# Altium schematic sheet Matrix.SchDoc
size A3; DocumentNumber: 3; SheetNumber: 3; SheetTotal: 3
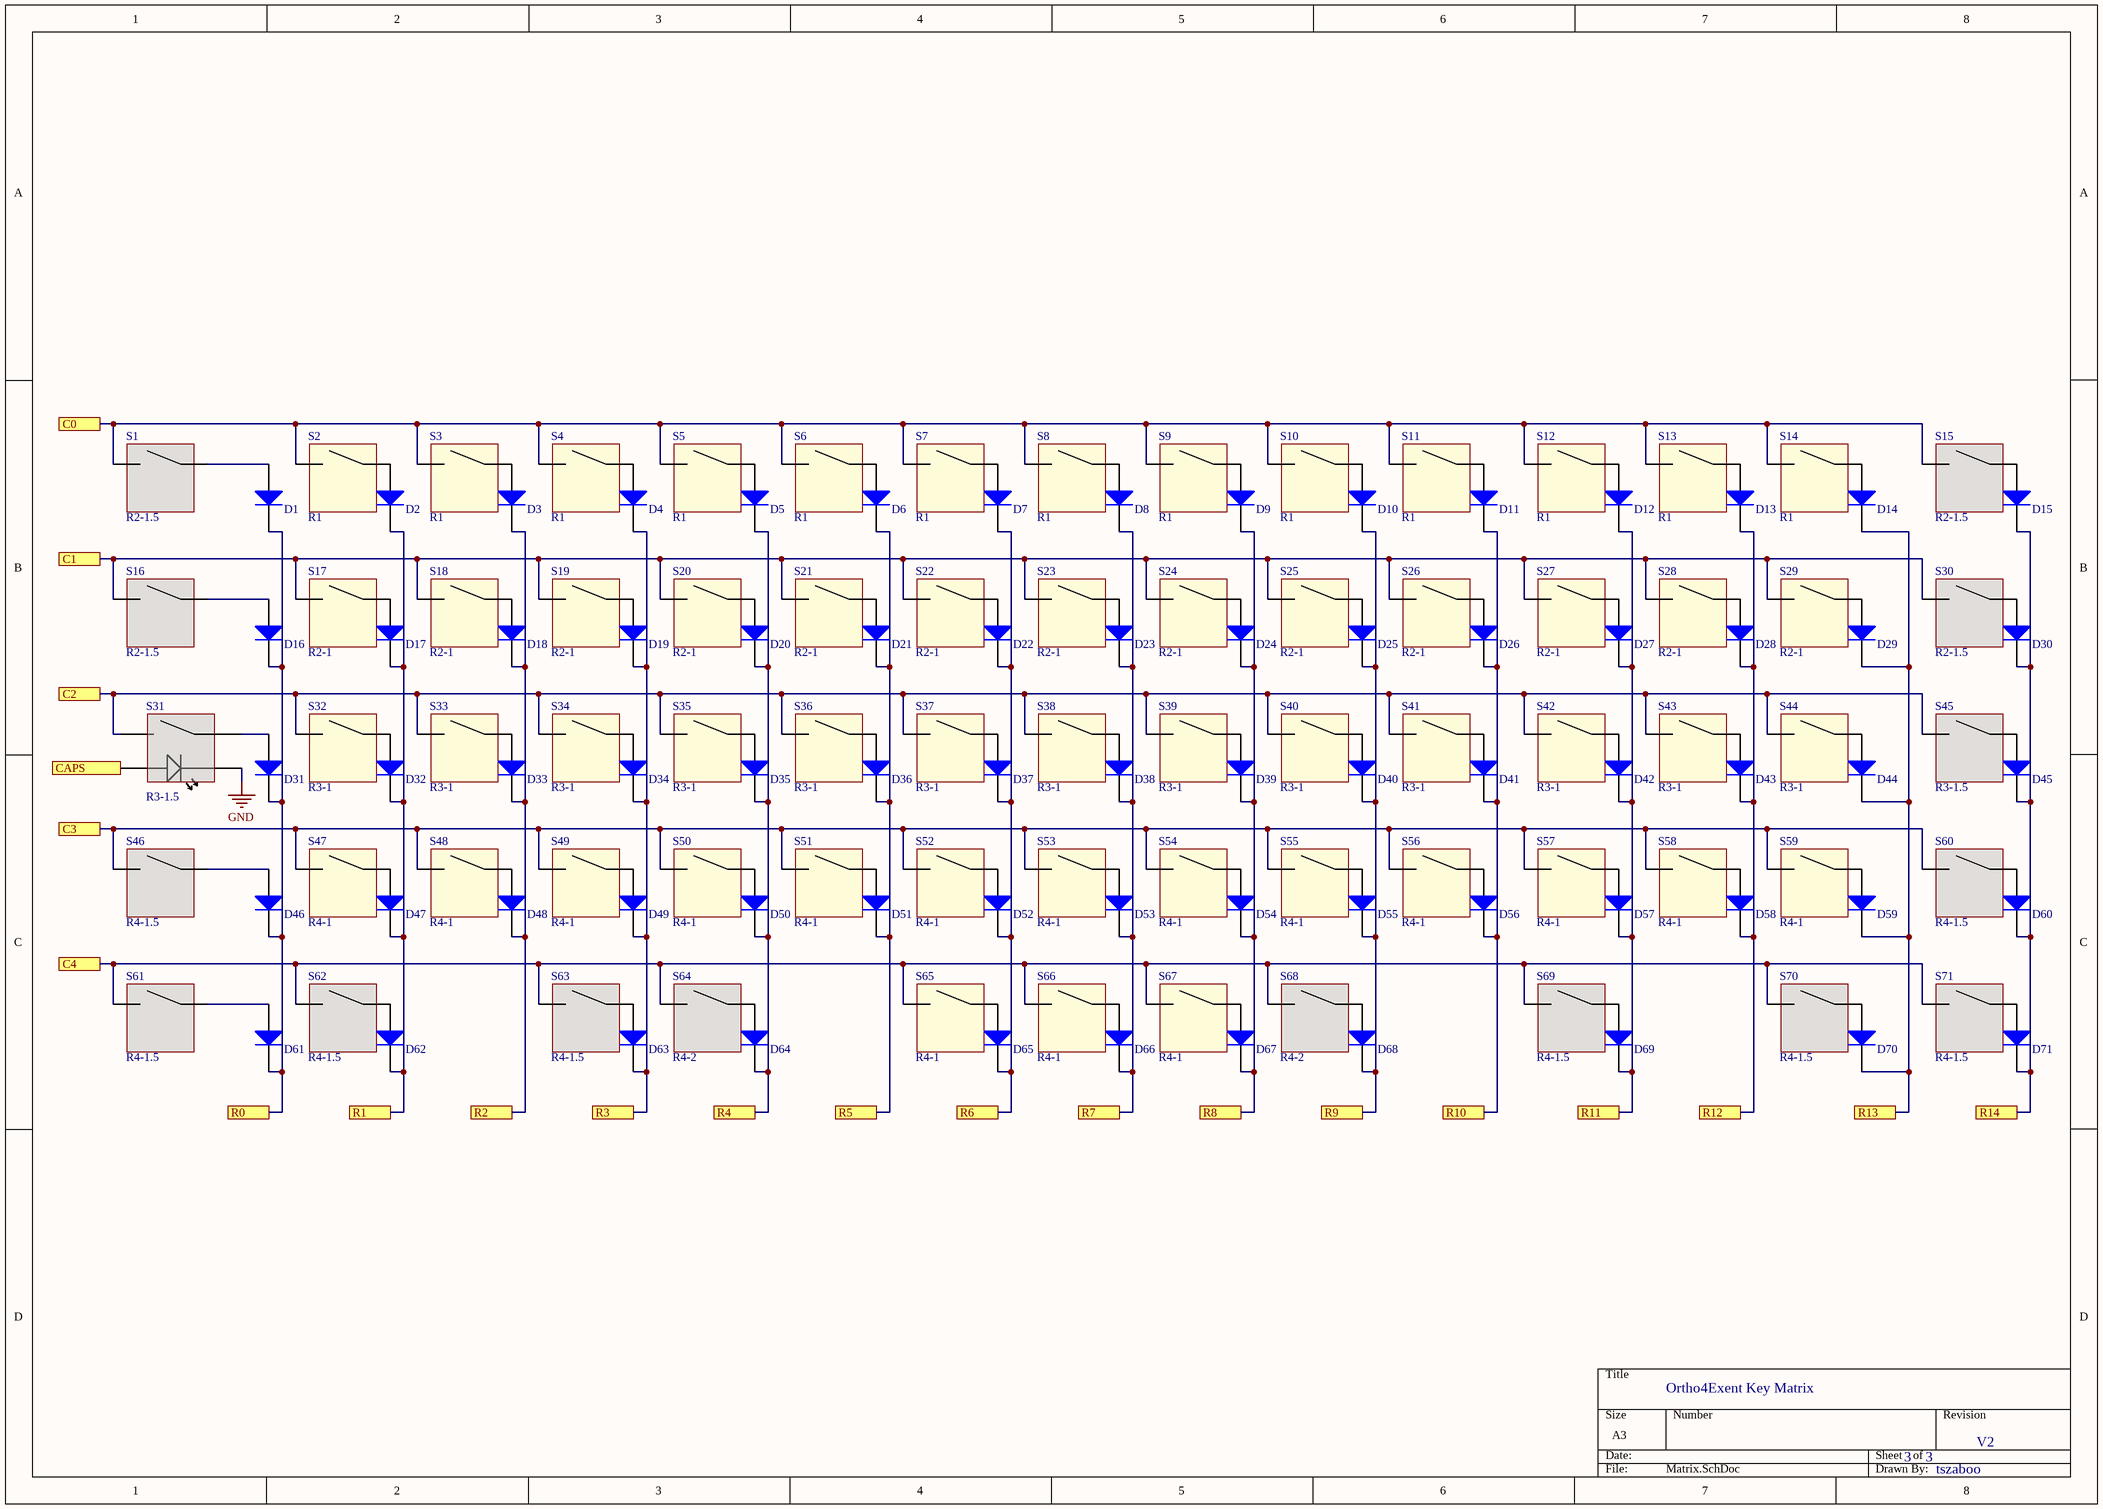
[diagram p0: Matrix.SchDoc]

## Parts
D1  1N4148WS  [SOD323FL]  (value not drawn)
D2  1N4148WS  [SOD323FL]  (value not drawn)
D3  1N4148WS  [SOD323FL]  (value not drawn)
D4  1N4148WS  [SOD323FL]  (value not drawn)
D5  1N4148WS  [SOD323FL]  (value not drawn)
D6  1N4148WS  [SOD323FL]  (value not drawn)
D7  1N4148WS  [SOD323FL]  (value not drawn)
D8  1N4148WS  [SOD323FL]  (value not drawn)
D9  1N4148WS  [SOD323FL]  (value not drawn)
D10  1N4148WS  [SOD323FL]  (value not drawn)
D11  1N4148WS  [SOD323FL]  (value not drawn)
D12  1N4148WS  [SOD323FL]  (value not drawn)
D13  1N4148WS  [SOD323FL]  (value not drawn)
D14  1N4148WS  [SOD323FL]  (value not drawn)
D15  1N4148WS  [SOD323FL]  (value not drawn)
D16  1N4148WS  [SOD323FL]  (value not drawn)
D17  1N4148WS  [SOD323FL]  (value not drawn)
D18  1N4148WS  [SOD323FL]  (value not drawn)
D19  1N4148WS  [SOD323FL]  (value not drawn)
D20  1N4148WS  [SOD323FL]  (value not drawn)
D21  1N4148WS  [SOD323FL]  (value not drawn)
D22  1N4148WS  [SOD323FL]  (value not drawn)
D23  1N4148WS  [SOD323FL]  (value not drawn)
D24  1N4148WS  [SOD323FL]  (value not drawn)
D25  1N4148WS  [SOD323FL]  (value not drawn)
D26  1N4148WS  [SOD323FL]  (value not drawn)
D27  1N4148WS  [SOD323FL]  (value not drawn)
D28  1N4148WS  [SOD323FL]  (value not drawn)
D29  1N4148WS  [SOD323FL]  (value not drawn)
D30  1N4148WS  [SOD323FL]  (value not drawn)
D31  1N4148WS  [SOD323FL]  (value not drawn)
D32  1N4148WS  [SOD323FL]  (value not drawn)
D33  1N4148WS  [SOD323FL]  (value not drawn)
D34  1N4148WS  [SOD323FL]  (value not drawn)
D35  1N4148WS  [SOD323FL]  (value not drawn)
D36  1N4148WS  [SOD323FL]  (value not drawn)
D37  1N4148WS  [SOD323FL]  (value not drawn)
D38  1N4148WS  [SOD323FL]  (value not drawn)
D39  1N4148WS  [SOD323FL]  (value not drawn)
D40  1N4148WS  [SOD323FL]  (value not drawn)
D41  1N4148WS  [SOD323FL]  (value not drawn)
D42  1N4148WS  [SOD323FL]  (value not drawn)
D43  1N4148WS  [SOD323FL]  (value not drawn)
D44  1N4148WS  [SOD323FL]  (value not drawn)
D45  1N4148WS  [SOD323FL]  (value not drawn)
D46  1N4148WS  [SOD323FL]  (value not drawn)
D47  1N4148WS  [SOD323FL]  (value not drawn)
D48  1N4148WS  [SOD323FL]  (value not drawn)
D49  1N4148WS  [SOD323FL]  (value not drawn)
D50  1N4148WS  [SOD323FL]  (value not drawn)
D51  1N4148WS  [SOD323FL]  (value not drawn)
D52  1N4148WS  [SOD323FL]  (value not drawn)
D53  1N4148WS  [SOD323FL]  (value not drawn)
D54  1N4148WS  [SOD323FL]  (value not drawn)
D55  1N4148WS  [SOD323FL]  (value not drawn)
D56  1N4148WS  [SOD323FL]  (value not drawn)
D57  1N4148WS  [SOD323FL]  (value not drawn)
D58  1N4148WS  [SOD323FL]  (value not drawn)
D59  1N4148WS  [SOD323FL]  (value not drawn)
D60  1N4148WS  [SOD323FL]  (value not drawn)
D61  1N4148WS  [SOD323FL]  (value not drawn)
D62  1N4148WS  [SOD323FL]  (value not drawn)
D63  1N4148WS  [SOD323FL]  (value not drawn)
D64  1N4148WS  [SOD323FL]  (value not drawn)
D65  1N4148WS  [SOD323FL]  (value not drawn)
D66  1N4148WS  [SOD323FL]  (value not drawn)
D67  1N4148WS  [SOD323FL]  (value not drawn)
D68  1N4148WS  [SOD323FL]  (value not drawn)
D69  1N4148WS  [SOD323FL]  (value not drawn)
D70  1N4148WS  [SOD323FL]  (value not drawn)
D71  1N4148WS  [SOD323FL]  (value not drawn)
S1  R2-1.5  [R2-1.5 NOLED]
S2  R1  [R1 NOLED]
S3  R1  [R1 NOLED]
S4  R1  [R1 NOLED]
S5  R1  [R1 NOLED]
S6  R1  [R1 NOLED]
S7  R1  [R1 NOLED]
S8  R1  [R1-1 NOLED 180]
S9  R1  [R1 NOLED]
S10  R1  [R1 NOLED]
S11  R1  [R1 NOLED]
S12  R1  [R1 NOLED]
S13  R1  [R1 NOLED]
S14  R1  [R1 NOLED]
S15  R2-1.5  [R2-1.5 NOLED]
S16  R2-1.5  [R2-1.5 NOLED]
S17  R2-1  [R2-1 NOLED]
S18  R2-1  [R2-1 NOLED]
S19  R2-1  [R2-1 NOLED]
S20  R2-1  [R2-1 NOLED]
S21  R2-1  [R2-1 NOLED]
S22  R2-1  [R2-1 NOLED]
S23  R2-1  [R2-1 NOLED]
S24  R2-1  [R2-1 NOLED]
S25  R2-1  [R2-1 NOLED]
S26  R2-1  [R2-1 NOLED]
S27  R2-1  [R2-1 NOLED]
S28  R2-1  [R2-1 NOLED]
S29  R2-1  [R2-1 NOLED]
S30  R2-1.5  [R2-1.5 NOLED]
S31  R3-1.5  [R3-1.5]
S32  R3-1  [R3-1 NOLED]
S33  R3-1  [R3-1 NOLED]
S34  R3-1  [R3-1 NOLED]
S35  R3-1  [R3-1 NOLED]
S36  R3-1  [R3-1 NOLED]
S37  R3-1  [R3-1 NOLED]
S38  R3-1  [R3-1 NOLED]
S39  R3-1  [R3-1 NOLED]
S40  R3-1  [R3-1 NOLED]
S41  R3-1  [R3-1 NOLED]
S42  R3-1  [R3-1 NOLED]
S43  R3-1  [R3-1 NOLED]
S44  R3-1  [R3-1 NOLED]
S45  R3-1.5  [R3-1.5 NOLED]
S46  R4-1.5  [R4-1.5 NOLED]
S47  R4-1  [R4-1 NOLED]
S48  R4-1  [R4-1 NOLED]
S49  R4-1  [R4-1 NOLED]
S50  R4-1  [R4-1 NOLED]
S51  R4-1  [R4-1 NOLED]
S52  R4-1  [R4-1 NOLED]
S53  R4-1  [R4-1 NOLED]
S54  R4-1  [R4-1 NOLED]
S55  R4-1  [R4-1 NOLED]
S56  R4-1  [R4-1 NOLED]
S57  R4-1  [R4-1 NOLED]
S58  R4-1  [R4-1 NOLED]
S59  R4-1  [R4-1 NOLED]
S60  R4-1.5  [R4-1.5 NOLED]
S61  R4-1.5  [R4-1.5 NOLED]  (no BOM)
S62  R4-1.5  [R4-1.5 NOLED]
S63  R4-1.5  [R4-1.5 NOLED]
S64  R4-2  [R4-2 NOLED 180]
S65  R4-1  [R4-1 NOLED]
S66  R4-1  [R4-1 NOLED]
S67  R4-1  [R4-1 NOLED]
S68  R4-2  [R4-2 NOLED 180]
S69  R4-1.5  [R4-1.5 NOLED]
S70  R4-1.5  [R4-1.5 NOLED]
S71  R4-1.5  [R4-1.5 NOLED]

## Ports
C0, C1, C2, C3, C4, CAPS, R0, R1, R2, R3, R4, R5, R6, R7, R8, R9, R10, R11, R12, R13, R14

## Nets
GND: S31.3
C0: S1.1 S2.1 S3.1 S4.1 S5.1 S6.1 S7.1 S8.1 S9.1 S10.1 S11.1 S12.1 S13.1 S14.1 S15.1 ; port C0
C1: S16.1 S17.1 S18.1 S19.1 S20.1 S21.1 S22.1 S23.1 S24.1 S25.1 S26.1 S27.1 S28.1 S29.1 S30.1 ; port C1
C2: S31.1 S32.1 S33.1 S34.1 S35.1 S36.1 S37.1 S38.1 S39.1 S40.1 S41.1 S42.1 S43.1 S44.1 S45.1 ; port C2
C3: S46.1 S47.1 S48.1 S49.1 S50.1 S51.1 S52.1 S53.1 S54.1 S55.1 S56.1 S57.1 S58.1 S59.1 S60.1 ; port C3
C4: S61.1 S62.1 S63.1 S64.1 S65.1 S66.1 S67.1 S68.1 S69.1 S70.1 S71.1 ; port C4
CAPS: S31.4 ; port CAPS
R0: D1.2(K) D16.2(K) D31.2(K) D46.2(K) D61.2(K) ; port R0
R1: D2.2(K) D17.2(K) D32.2(K) D47.2(K) D62.2(K) ; port R1
R2: D3.2(K) D18.2(K) D33.2(K) D48.2(K) ; port R2
R3: D4.2(K) D19.2(K) D34.2(K) D49.2(K) D63.2(K) ; port R3
R4: D5.2(K) D20.2(K) D35.2(K) D50.2(K) D64.2(K) ; port R4
R5: D6.2(K) D21.2(K) D36.2(K) D51.2(K) ; port R5
R6: D7.2(K) D22.2(K) D37.2(K) D52.2(K) D65.2(K) ; port R6
R7: D8.2(K) D23.2(K) D38.2(K) D53.2(K) D66.2(K) ; port R7
R8: D9.2(K) D24.2(K) D39.2(K) D54.2(K) D67.2(K) ; port R8
R9: D10.2(K) D25.2(K) D40.2(K) D55.2(K) D68.2(K) ; port R9
R10: D11.2(K) D26.2(K) D41.2(K) D56.2(K) ; port R10
R11: D12.2(K) D27.2(K) D42.2(K) D57.2(K) D69.2(K) ; port R11
R12: D13.2(K) D28.2(K) D43.2(K) D58.2(K) ; port R12
R13: D14.2(K) D29.2(K) D44.2(K) D59.2(K) D70.2(K) ; port R13
R14: D15.2(K) D30.2(K) D45.2(K) D60.2(K) D71.2(K) ; port R14
NetD1_1: D1.1(A) S1.2
NetD2_1: D2.1(A) S2.2
NetD3_1: D3.1(A) S3.2
NetD4_1: D4.1(A) S4.2
NetD5_1: D5.1(A) S5.2
NetD6_1: D6.1(A) S6.2
NetD7_1: D7.1(A) S7.2
NetD8_1: D8.1(A) S8.2
NetD9_1: D9.1(A) S9.2
NetD10_1: D10.1(A) S10.2
NetD11_1: D11.1(A) S11.2
NetD12_1: D12.1(A) S12.2
NetD13_1: D13.1(A) S13.2
NetD14_1: D14.1(A) S14.2
NetD15_1: D15.1(A) S15.2
NetD16_1: D16.1(A) S16.2
NetD17_1: D17.1(A) S17.2
NetD18_1: D18.1(A) S18.2
NetD19_1: D19.1(A) S19.2
NetD20_1: D20.1(A) S20.2
NetD21_1: D21.1(A) S21.2
NetD22_1: D22.1(A) S22.2
NetD23_1: D23.1(A) S23.2
NetD24_1: D24.1(A) S24.2
NetD25_1: D25.1(A) S25.2
NetD26_1: D26.1(A) S26.2
NetD27_1: D27.1(A) S27.2
NetD28_1: D28.1(A) S28.2
NetD29_1: D29.1(A) S29.2
NetD30_1: D30.1(A) S30.2
NetD31_1: D31.1(A) S31.2
NetD32_1: D32.1(A) S32.2
NetD33_1: D33.1(A) S33.2
NetD34_1: D34.1(A) S34.2
NetD35_1: D35.1(A) S35.2
NetD36_1: D36.1(A) S36.2
NetD37_1: D37.1(A) S37.2
NetD38_1: D38.1(A) S38.2
NetD39_1: D39.1(A) S39.2
NetD40_1: D40.1(A) S40.2
NetD41_1: D41.1(A) S41.2
NetD42_1: D42.1(A) S42.2
NetD43_1: D43.1(A) S43.2
NetD44_1: D44.1(A) S44.2
NetD45_1: D45.1(A) S45.2
NetD46_1: D46.1(A) S46.2
NetD47_1: D47.1(A) S47.2
NetD48_1: D48.1(A) S48.2
NetD49_1: D49.1(A) S49.2
NetD50_1: D50.1(A) S50.2
NetD51_1: D51.1(A) S51.2
NetD52_1: D52.1(A) S52.2
NetD53_1: D53.1(A) S53.2
NetD54_1: D54.1(A) S54.2
NetD55_1: D55.1(A) S55.2
NetD56_1: D56.1(A) S56.2
NetD57_1: D57.1(A) S57.2
NetD58_1: D58.1(A) S58.2
NetD59_1: D59.1(A) S59.2
NetD60_1: D60.1(A) S60.2
NetD61_1: D61.1(A) S61.2
NetD62_1: D62.1(A) S62.2
NetD63_1: D63.1(A) S63.2
NetD64_1: D64.1(A) S64.2
NetD65_1: D65.1(A) S65.2
NetD66_1: D66.1(A) S66.2
NetD67_1: D67.1(A) S67.2
NetD68_1: D68.1(A) S68.2
NetD69_1: D69.1(A) S69.2
NetD70_1: D70.1(A) S70.2
NetD71_1: D71.1(A) S71.2

## Notes on the sheet
- Ortho4Exent Key Matrix
- 3
- V2
- tszaboo

## Library data of the parts
D1-D71 = 1N4148WS: Default Diode; MANUF: ON Semi; DESCIPTION: DIODE GEN PURP 80V 125MA SOD323; COMPATIBLES: True; NoPins: 2; GENERIC: 1N4148; MANUFCODE: 1N4148WS; DIGIKEY: 1N4148WSFSTR-ND; FARNELL: 2453270; SMD: True; PACKAGE: SOD323-FL